# Altium schematic sheet sensors.SchDoc
size A4; SheetNumber: 2; SheetTotal: 4
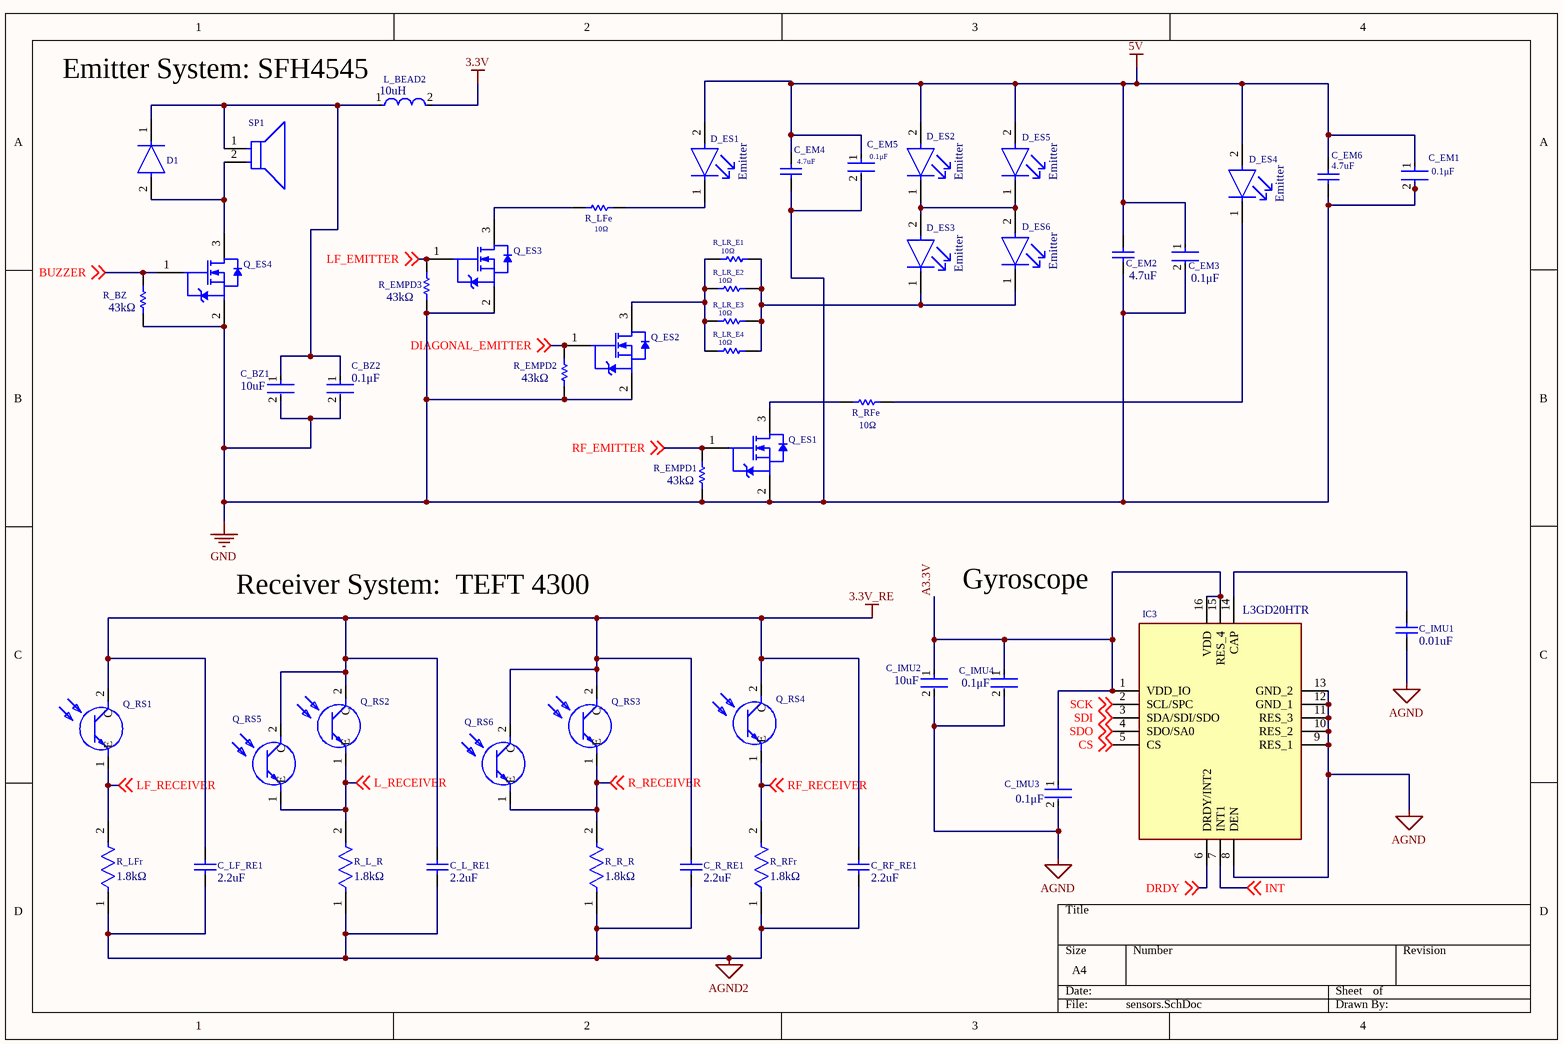
[diagram p0: sensors.SchDoc]

## Parts
C_BZ1  value 10uF  [FP-C0805C-DG-MFG]  (hidden comment: C0805C106K8PACTU)
C_BZ2  value 0.1μF  [FP-C0805C-DN-MFG]  (hidden comment: C0805C104J8RACTU)
C_EM1  value 0.1μF  [FP-C0805C-DN-MFG]  (hidden comment: C0805C104J8RACTU)
C_EM2  value 4.7uF  [CAPC2013X145X50NL20T25]  (hidden comment: C0805C475M3PACTU)
C_EM3  value 0.1μF  [FP-C0805C-DN-MFG]  (hidden comment: C0805C104J8RACTU)
C_EM4  value 4.7uF  [CAPC2013X145X50NL20T25]  (hidden comment: C0805C475M3PACTU)
C_EM5  value 0.1μF  [FP-C0805C-DN-MFG]  (hidden comment: C0805C104J8RACTU)
C_EM6  value 4.7uF  [CAPC2013X145X50NL20T25]  (hidden comment: C0805C475M3PACTU)
C_IMU1  value 0.01uF  [CAPC2013X88X50LL20T25]  (hidden comment: C0805C103K5RACTU)
C_IMU2  value 10uF  [FP-C0805C-DG-MFG]  (hidden comment: C0805C106K8PACTU)
C_IMU3  value 0.1μF  [FP-C0805C-DN-MFG]  (hidden comment: C0805C104J8RACTU)
C_IMU4  value 0.1μF  [FP-C0805C-DN-MFG]  (hidden comment: C0805C104J8RACTU)
C_L_RE1  value 2.2uF  [CAPC2013X145X50ML20T25]  (hidden comment: C0805C225K9PACTU)
C_LF_RE1  value 2.2uF  [CAPC2013X145X50ML20T25]  (hidden comment: C0805C225K9PACTU)
C_R_RE1  value 2.2uF  [CAPC2013X145X50ML20T25]  (hidden comment: C0805C225K9PACTU)
C_RF_RE1  value 2.2uF  [CAPC2013X145X50ML20T25]  (hidden comment: C0805C225K9PACTU)
D1  1N4148W-TP  [FP-SOD-123-IPC_A]  (value not drawn)
D_ES1  Emitter  [FP-SFH_4556-MFG]
D_ES2  Emitter  [FP-SFH_4556-MFG]
D_ES3  Emitter  [FP-SFH_4556-MFG]
D_ES4  Emitter  [FP-SFH_4556-MFG]
D_ES5  Emitter  [FP-SFH_4556-MFG]
D_ES6  Emitter  [FP-SFH_4556-MFG]
IC3  L3GD20HTR  [H3LIS100DLTR]
L_BEAD2  value 10uH  [FP-LB2012-1_25-0_2-MFG]  (hidden comment: LBR2012T100K)
Q_ES1  FDV303N  [FAIR-FDV303N-3_V]  (value not drawn)
Q_ES2  FDV303N  [FAIR-FDV303N-3_V]  (value not drawn)
Q_ES3  FDV303N  [FAIR-FDV303N-3_V]  (value not drawn)
Q_ES4  FDV303N  [FAIR-FDV303N-3_V]  (value not drawn)
Q_RS1  TEFT4300  [TEFT4300]  (value not drawn)
Q_RS2  TEFT4300  [TEFT4300]  (value not drawn)
Q_RS3  TEFT4300  [TEFT4300]  (value not drawn)
Q_RS4  TEFT4300  [TEFT4300]  (value not drawn)
Q_RS5  TEFT4300  [TEFT4300]  (value not drawn)
Q_RS6  TEFT4300  [TEFT4300]  (value not drawn)
R_BZ  value 43kΩ  [RESC1608X55X30NL20T20]  (hidden comment: ERA3AEB433V)
R_EMPD1  value 43kΩ  [RESC1608X55X30NL20T20]  (hidden comment: ERA3AEB433V)
R_EMPD2  value 43kΩ  [RESC1608X55X30NL20T20]  (hidden comment: ERA3AEB433V)
R_EMPD3  value 43kΩ  [RESC1608X55X30NL20T20]  (hidden comment: ERA3AEB433V)
R_L_R  value 1.8kΩ  [FP-RN732A-MFG]  (hidden comment: Y11721K80000T0R)
R_LFe  value 10Ω  [RESC2013X70X40NL20T20]  (hidden comment: ERJ-6ENF10R0V)
R_LFr  value 1.8kΩ  [FP-RN732A-MFG]  (hidden comment: Y11721K80000T0R)
R_LR_E1  value 10Ω  [RESC2013X70X40NL20T20]  (hidden comment: ERJ-6ENF10R0V)
R_LR_E2  value 10Ω  [RESC2013X70X40NL20T20]  (hidden comment: ERJ-6ENF10R0V)
R_LR_E3  value 10Ω  [RESC2013X70X40NL20T20]  (hidden comment: ERJ-6ENF10R0V)
R_LR_E4  value 10Ω  [RESC2013X70X40NL20T20]  (hidden comment: ERJ-6ENF10R0V)
R_R_R  value 1.8kΩ  [FP-RN732A-MFG]  (hidden comment: Y11721K80000T0R)
R_RFe  value 10Ω  [RESC2013X70X40NL20T20]  (hidden comment: ERJ-6ENF10R0V)
R_RFr  value 1.8kΩ  [FP-RN732A-MFG]  (hidden comment: Y11721K80000T0R)
SP1  AI-1223-TWT-3V-2-R  [FP-AI-1223-TWT-3V-2-R-MFG]  (value not drawn)

## Nets
3.3V: L_BEAD2.2
3.3V_RE: C_L_RE1.2 C_LF_RE1.2 C_R_RE1.2 C_RF_RE1.2 Q_RS1.2(C) Q_RS2.2(C) Q_RS3.2(C) Q_RS4.2(C) Q_RS5.2(C) Q_RS6.2(C)
5V: C_EM1.1 C_EM2.2 C_EM3.1 C_EM4.2 C_EM5.1 C_EM6.2 D_ES1.2(A) D_ES2.2(A) D_ES4.2(A) D_ES5.2(A)
AGND: C_IMU1.1 C_IMU2.2 C_IMU3.2 C_IMU4.2 IC3.8(DEN) IC3.9(RES_1) IC3.10(RES_2) IC3.11(RES_3) IC3.12(GND_1) IC3.13(GND_2)
AGND2: C_L_RE1.1 C_LF_RE1.1 C_R_RE1.1 R_L_R.1 R_LFr.1 R_R_R.1 R_RFr.1
GND: C_BZ1.2 C_BZ2.2 C_EM1.2 C_EM2.1 C_EM3.2 C_EM4.1 C_EM5.2 C_EM6.1 Q_ES1.2(S) Q_ES2.2(S) Q_ES3.2(S) Q_ES4.2(S) R_BZ.1 R_EMPD1.1 R_EMPD2.1 R_EMPD3.1
A3.3V: C_IMU2.1 C_IMU3.1 C_IMU4.1 IC3.1(VDD_IO) IC3.15(RES_4) IC3.16(VDD)
BUZZER: Q_ES4.1(G) R_BZ.2 ; off-sheet BUZZER
CS: IC3.5(CS) ; off-sheet CS
DIAGONAL_EMITTER: Q_ES2.1(G) R_EMPD2.2 ; off-sheet DIAGONAL_EMITTER
DRDY: IC3.6(DRDY/INT2) ; off-sheet DRDY
INT: IC3.7(INT1) ; off-sheet INT
L_RECEIVER: Q_RS2.1(E) Q_RS5.1(E) R_L_R.2 ; off-sheet L_RECEIVER
LF_EMITTER: Q_ES3.1(G) R_EMPD3.2 ; off-sheet LF_EMITTER
LF_RECEIVER: Q_RS1.1(E) R_LFr.2 ; off-sheet LF_RECEIVER
R_RECEIVER: Q_RS3.1(E) Q_RS6.1(E) R_R_R.2 ; off-sheet R_RECEIVER
RF_EMITTER: Q_ES1.1(G) R_EMPD1.2 ; off-sheet RF_EMITTER
RF_RECEIVER: Q_RS4.1(E) R_RFr.2 ; off-sheet RF_RECEIVER
SCK: IC3.2(SCL/SPC) ; off-sheet SCK
SDI: IC3.3(SDA/SDI/SDO) ; off-sheet SDI
SDO: IC3.4(SDO/SA0) ; off-sheet SDO
NetC_BZ1_1: C_BZ1.1 C_BZ2.1 D1.1(C) L_BEAD2.1 SP1.1(C)
NetC_IMU1_2: C_IMU1.2 IC3.14(CAP)
NetD1_2: D1.2(A) Q_ES4.3(D) SP1.2(A)
NetD_ES1_1: D_ES1.1(C) R_LFe.2
NetD_ES2_1: D_ES2.1(C) D_ES3.2(A) D_ES5.1(C) D_ES6.2(A)
NetD_ES3_1: D_ES3.1(C) D_ES6.1(C) R_LR_E1.2 R_LR_E2.2 R_LR_E3.2 R_LR_E4.2
NetD_ES4_1: D_ES4.1(C) R_RFe.2
NetQ_ES1_3: Q_ES1.3(D) R_RFe.1
NetQ_ES2_3: Q_ES2.3(D) R_LR_E1.1 R_LR_E2.1 R_LR_E3.1 R_LR_E4.1
NetQ_ES3_3: Q_ES3.3(D) R_LFe.1

Not connected (* = marked no-connect by the designer): C_RF_RE1 1

## Notes on the sheet
- (near L_BEAD2) Emitter System: SFH4545
- Gyroscope
- Receiver System:  TEFT 4300

## Library data of the parts
C_BZ1 C_IMU2 = CMP-2007-03243-2: CAP CER 10UF 10V X5R 0805; Manufacturer: Kemet; 3DS Part Number: 220-00001; Tolerance: 10%; Temperature Coefficient: 15%; Device Class L2: Capacitors; Device Class L1: Passive Components; ComponentLink2URL: https://content.kemet.com/datasheets/KEM_C1006_X5R_SMD.pdf; Height: 1.4mm; Lead Free: Yes; Manufacturer Part Number: C0805C106K8PACTU; Digikey Description: CAP CER 10UF 10V X5R 0805; Octopart: https://octopart.com/c0805c106k8pactu-kemet-98697; Capacitance: 10uF; Temperature Range Low: -55°C; Temperature: -55°C to +85°C; Automotive: No; Mouser Description: CAP CER 10UF 10V X5R 0805; Ipc Land Pattern Name: CAPC200125X125; Material: Ceramic; Temperature Range High: +85°C; Voltage: 10V; RoHS: TRUE; Device Class L3: Ceramic Capacitors; ComponentLink2Description: Datasheet; Voltage Rating: 10V; Package: C0805C-DG; Temperature Characteristic: X5R; Category: Cap
C_BZ2 C_EM1 C_EM3 C_EM5 C_IMU3 C_IMU4 = CMP-03020-032188-1: CAP CER 0.1UF 10V 5% X7R 0805; Manufacturer: KEMET; Tolerance: 0.05; Capacitance: 0.10 μF; Temperature Coefficient: 30ppm/°C; Package: C0805C-DN; Device Class L1: Passive Components; Temperature: -55°C to +125°C; Category: Cap; RoHS: TRUE; Mouser Description: Multilayer Ceramic Capacitors MLCC - SMD/SMT 10volts 0.1uF X7R 5%; Lead Free: Yes; Temperature Range Low: -55°C; Material: Ceramic; Temperature Range High: +125°C; Device Class L2: Capacitors; Temperature Characteristic: X7R; Device Class L3: Ceramic Capacitors; ComponentLink2Description: Datasheet; Automotive: No; Ipc Land Pattern Name: CAPC200125X78; Manufacturer Part Number: C0805C104J8RACTU; Voltage Rating: 10 V; Height: 0.88mm; Digikey Description: CAP CER 0.1UF 10V 5% X7R 0805; Octopart: https://octopart.com/c0805c104j8ractu-kemet-11807087; ComponentLink2URL: https://content.kemet.com/datasheets/KEM_C1003_C0G_SMD.pdf
C_EM2 C_EM4 C_EM6 = CMP-2007-01014-1: Manufacturer: Kemet; Part Number: C0805C475M3PACTU; Capacitance: 4.7uF
C_IMU1 = CMP-2007-00266-1: Manufacturer: Kemet; Part Number: C0805C103K5RACTU; Capacitance: 0.01uF
C_L_RE1 C_LF_RE1 C_R_RE1 C_RF_RE1 = CMP-1036-04819-2: Manufacturer: Kemet; Part Number: C0805C225K9PACTU
D1 = CMP-2000-04993-2: DIODE GEN PURP 100V 150MA SOD123; Max Reverse Leakage Current: 5uA; Max Surge Current: 2A; Reverse Recovery Time: 4ns; Polarity: Standard; Capacitance: 4pF; Max Forward Surge Current (Ifsm): 1A; Element Configuration: Single; Power Dissipation: 400mW; Forward Voltage: 1V; Radiation Hardening: No; Lead Free: Lead Free; Max Reverse Voltage (DC): 100V; Current Rating: 150mA; Forward Current: 150mA; Packaging: Tape and Reel; Number of Pins: 2; Package Quantity: 3000; Max Operating Temperature: 150°C; Min Operating Temperature: -65°C; Average Rectified Current: 150mA; Recovery Time: 4ns; Output Current: 150mA; Peak Non-Repetitive Surge Current: 2A; Width: 1.8mm; Voltage Rating (DC): 100V; Height: 1.2mm; Max Repetitive Reverse Voltage (Vrrm): 100V; Mount: Surface Mount; Length: 2.85mm; Value: 1N4148W
D_ES1-D_ES6 = CMP-62016-000017-1: EMITTER IR 950NM 100MA RADIAL; Manufacturer: Osram Opto; Viewing Angle: 10°; Reverse Voltage: 12V; Led Orientation: Straight; Forward Voltage: 1.5V; Automotive: No; ComponentLink2URL: https://dammedia.osram.info/media/resource/hires/osram-dam-2496340/SFH%204556.pdf; Temperature: -40°C to +100°C; Device Class L1: Optoelectronics; Colour: Infrared; RoHS: TRUE; Manufacturer Part Number: SFH 4545; Peak Emmision Wavelength: 950nm; Temperature Range Low: -40°C; Device Class L2: LEDs; Package: SFH 4545; ComponentLink2Description: Datasheet; Device Class L3: unset; Digikey Description: EMITTER IR 950NM 100MA RADIAL; Forward Current: 100mA; Mouser Description: SFH 4556 Osram Opto, 860nm IR LED, 5mm (T-1 3/4) Through Hole package; Lead Free: Yes; Temperature Range High: +100°C; Category: Diode
IC3 = L3GD20HTR: Integrated Circuit; Manufacturer_Name: STMicroelectronics; Datasheet Link: http://www.st.com/content/ccc/resource/technical/document/datasheet/35/b1/e0/39/71/57/43/01/DM00060659.pdf/files/DM00060659.pdf/jcr:content/translations/en.DM00060659.pdf; Height: 1mm; Manufacturer_Part_Number: L3GD20HTR; Mouser Part Number: 511-L3GD20HTR; Mouser Price/Stock: https://www.mouser.co.uk/ProductDetail/STMicroelectronics/L3GD20HTR?qs=7v3IMFVTeKNoM%2F2Sb4QSlQ%3D%3D; Arrow Part Number: L3GD20HTR; Arrow Price/Stock: https://www.arrow.com/en/products/l3gd20htr/stmicroelectronics
L_BEAD2 = CMP-14484-000421-1: SMD Inductors 10uH ±10% 0.15A 0.468Ω 0805; DC Current: 150mA; Core Material: Ferrite; Shielding: Unshielded; Test Frequency: 2.52MHz; DC Resistance (DCR): 360mR; Self Resonant Frequency: 32MHz; Military Standard: Not; Termination: SMD/SMT; Height - Seated (Max): 0.057inch; Current Rating: 150mA; Tolerance: 10%; Case Code (Imperial): 0805; Radiation Hardening: No; Inductance: 10uH; Resistor Type: Wirewound; Length: 0.079inch; Weight: 0.000194oz; Case Code (Metric): 2012; Max Operating Temperature: 105°C; Height: 1.6mm; Packaging: Tape and Reel; Lead Pitch: 1mm; Case/Package: 0805; Depth: 1.45mm; Series: LB; Mount: Surface Mount; Min Operating Temperature: -40°C; Inductance Tolerance: 10%; RoHS Compliant: Yes; Max DC Current: 150mA; Package Quantity: 3000; Lead Free: Lead Free; Width: 1.6mm; Halogen Free: Halogen Free
Q_ES1-Q_ES4 = CMP-2000-05111-1: N-Channel MOSFET Transistor, 8 V VGSS, 25 V VDSS, 0.68 A, -55 to 150 degC, 3-Pin SOT23, RoHS, Tape and Reel; Manufacturer: Fairchild; Typical Turn-On Delay Time: 3ns; Channel Mode: Enhancement; RDS-on: 450@4.5VmOhm; Maximum Continuous Drain Current: 0.68A; Maximum Drain Source Voltage: 25V; Rad Hard: No; Typical Fall Time: 13ns; Channel Type: N; Typical Turn-Off Delay Time: 17ns; Maximum Gate Source Voltage: 8V; Typical Rise Time: 8.5ns; Mounting: SurfaceMount; Packaging: Tape&Reel; Manufacturer URL: https://www.fairchildsemi.com/; Datasheet URL: https://datasheet.ciiva.com/22681/1845307-22681736.pdf; Package: 3SOT-23; Category: MOSFET; Operating Temperature: -55to150degC; Datasheet Version: Rev. D2, 07/2014
Q_RS1-Q_RS6 = TEFT4300: Phototransistor; Manufacturer_Name: Vishay; Datasheet Link: https://datasheet.datasheetarchive.com/originals/distributors/Datasheets-310/86913.pdf; Height: 6.1mm; Manufacturer_Part_Number: TEFT4300; Mouser Part Number: 782-TEFT4300; Mouser Price/Stock: https://www.mouser.co.uk/ProductDetail/Vishay-Semiconductors/TEFT4300?qs=HsFHTXumnCRbcrt8oPFPMA%3D%3D; Arrow Part Number: TEFT4300; Arrow Price/Stock: https://www.arrow.com/en/products/teft4300/vishay?region=nac
R_BZ R_EMPD1-R_EMPD3 = CMP-2000-00064-1: Manufacturer: Panasonic; Part Number: ERA3AEB433V; Resistance: 43kΩ
R_L_R R_LFr R_R_R R_RFr = CMP-03211-001802-1: SMD Chip Resistor, Thin Film, 1.8KΩ, 100 V, 0805 [2012 Metric], 100 mW, 0.1%, RN73 Series; Manufacturer Part Number: RN73C2A1K91BTDF; Manufacturer: TE Connectivity; Power Rating: 0.1W; Temperature Coefficient: 10ppm/°C; Voltage Rating: 100V; Automotive: No; Lead Free: Yes; Device Class L1: Passive Components; Device Class L2: Resistors; Category: Res; Resistance: 1.8kΩ; Temperature Range High: 155°C; packaging: 1000 Reel; Octopart: https://octopart.com/rn73c2a1k91btdf-te+connectivity-42431691; octopart_url: https://octopart.com/rn73c2a1k91btdf-te+connectivity-42431691; Package: RN732A; Temperature: -55°C to 155°C; Composition: Thin Film; RoHS: TRUE; Ipc Land Pattern Name: RESC200125X55; ComponentLink2Description: Datasheet; Height: 0.65mm; Tolerance: 0.1%; Series: RN73; Device Class L3: Chip SMD Resistors; Temperature Range Low: -55°C; ComponentLink2URL: https://www.te.com/commerce/DocumentDelivery/DDEController?Action=showdoc&DocId=Data+Sheet%7F1773270%7FP%7Fpdf%7FEnglish%7FENG_DS_1773270_P.pdf%7F1676162-2
R_LFe R_LR_E1-R_LR_E4 R_RFe = CMP-1013-00284-2: Manufacturer: Panasonic; Part Number: ERJ-6ENF10R0V; Resistance: 10Ω
SP1 = CMP-103888-000003-1: BUZZER MAGNETIC 3V 12MM TH; Min Supply Voltage (DC): 2V; Operating Supply Current: 30mA; Max Supply Voltage (DC): 4V; Input Type: DC; Frequency: 2.3kHz; Series: AI; Nominal Supply Voltage (DC): 3V; Packaging: Tray; Max Operating Temperature: 70°C; Height: 7.5mm; Termination: PC Pins; Max Supply Current: 30mA; Mount: Through Hole; Diameter: 12mm; Voltage Rating: 3V; Sensing Method: Magnetic; Min Operating Temperature: -20°C; Contact Plating: Tin